# Altium project cando_pro.PrjPcb
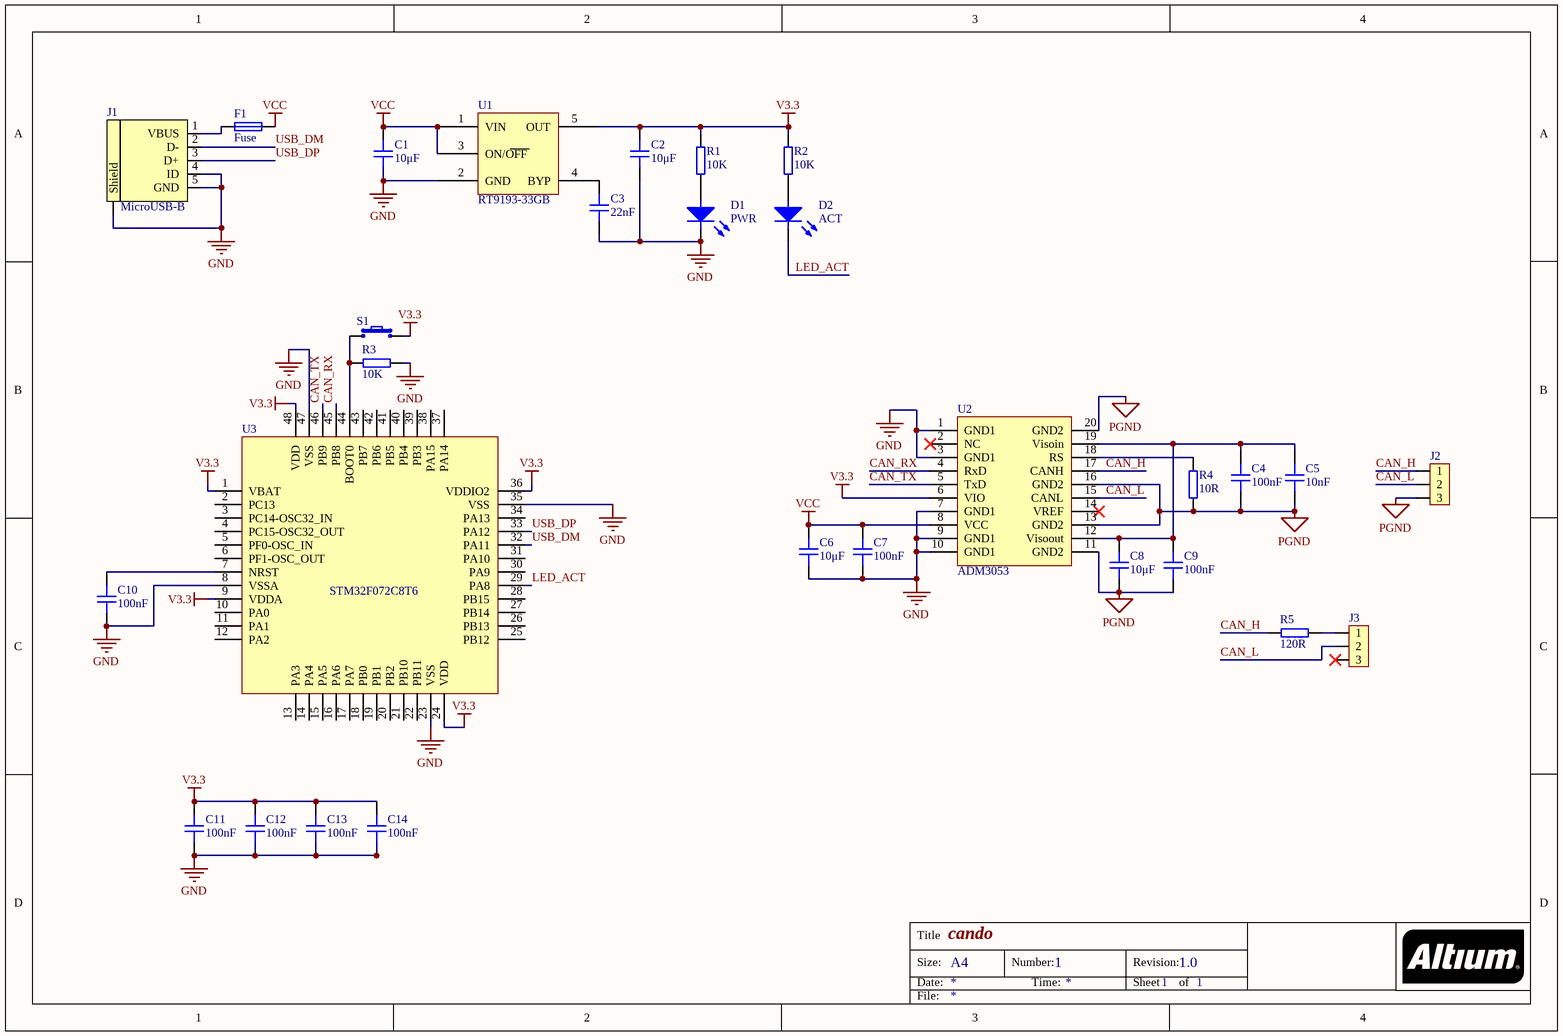
[diagram p0: cando_pro.SchDoc]
1 sheet, 29 parts. Net scope: global (net labels, ports and power ports of the same name join across sheets).
Board files: cando_pro.PcbDoc, cando_pro_set.PcbDoc

## Sheet cando_pro.SchDoc: cando
size A4; DocumentNumber: 1; Revision: 1.0; SheetNumber: 1; SheetTotal: 1; DrawnBy: SU; DocumentSize: A4; PCAName: cando

### Parts
C1  10μF  [0603C]
C2  10μF  [0603C]
C3  22nF  [0603C]
C4  100nF  [0603C]
C5  10nF  [0603C]
C6  10μF  [0603C]
C7  100nF  [0603C]
C8  10μF  [0603C]
C9  100nF  [0603C]
C10  100nF  [0603C]
C11  100nF  [0603C]
C12  100nF  [0603C]
C13  100nF  [0603C]
C14  100nF  [0603C]
D1  PWR  [LED_0603_GREEN]
D2  ACT  [LED_0603_BLUE]
F1  Fuse  [0805R]
J1  MicroUSB-B  [USB-Micro]
J2  (no value)  [MKDSN-2.54-3P]
J3  (no value)  [HEADER_2.54_3P]
R1  10K  [0603R]
R2  10K  [0603R]
R3  10K  [0603R]
R4  10R  [0603R]
R5  120R  [0603R]
S1  Button  [BTN_3*4]  (value not drawn)
U1  RT9193-33GB  [SOT-23-5]
U2  ADM3053  [RW-20]
U3  STM32F072C8T6  [STM-LQFP48_N]

### Nets
GND: C1.2 C2.2 C3.1 C6.2 C7.2 C10.2 C11.2 C12.2 C13.2 C14.2 D1.2(K) J1.4(ID) J1.5(GND) J1.6(Shield) R3.2 U1.2(GND) U2.1(GND1) U2.3(GND1) U2.7(GND1) U2.9(GND1) U2.10(GND1) U3.8(VSSA) U3.23(VSS) U3.35(VSS) U3.47(VSS)
PGND: C4.2 C5.2 C8.2 C9.2 J2.3 R4.1 U2.11(GND2) U2.13(GND2) U2.16(GND2) U2.20(GND2)
V3.3: C2.1 C11.1 C12.1 C13.1 C14.1 R1.1 R2.1 S1.2 U1.5(OUT) U2.6(VIO) U3.1(VBAT) U3.9(VDDA) U3.24(VDD) U3.36(VDDIO2) U3.48(VDD)
VCC: C1.1 C6.1 C7.1 F1.2 U1.1(VIN) U1.3(ON/OFF) U2.8(VCC)
CAN_H: J2.1 R5.1 U2.17(CANH)
CAN_L: J2.2 J3.2 U2.15(CANL)
CAN_RX: U2.4(RxD) U3.45(PB8)
CAN_TX: U2.5(TxD) U3.46(PB9)
LED_ACT: D2.2(K) U3.29(PA8)
USB_DM: J1.2(D-) U3.32(PA11)
USB_DP: J1.3(D+) U3.33(PA12)
NetC3_2: C3.2 U1.4(BYP)
NetC4_1: C4.1 C5.1 C8.1 C9.1 U2.12(Visoout) U2.19(Visoin)
NetC10_1: C10.1 U3.7(NRST)
NetD1_1: D1.1(A) R1.2
NetD2_1: D2.1(A) R2.2
NetF1_1: F1.1 J1.1(VBUS)
NetJ3_1: J3.1 R5.2
NetR3_1: R3.1 S1.1 U3.44(BOOT0)
NetR4_2: R4.2 U2.18(RS)

Not connected (* = marked no-connect by the designer): J3 3*; U2 2(NC)* 14(VREF)*; U3 2(PC13) 3(PC14-OSC32_IN) 4(PC15-OSC32_OUT) 5(PF0-OSC_IN) 6(PF1-OSC_OUT) 10(PA0) 11(PA1) 12(PA2) 13(PA3) 14(PA4) 15(PA5) 16(PA6) 17(PA7) 18(PB0) 19(PB1) 20(PB2) 21(PB10) 22(PB11) 25(PB12) 26(PB13) 27(PB14) 28(PB15) 30(PA9) 31(PA10) 34(PA13) 37(PA14) 38(PA15) 39(PB3) 40(PB4) 41(PB5) 42(PB6) 43(PB7)

### Notes on the sheet
- Title
- Size:
- Date:
- A4
- Number:
- Time:
- Revision:
- Sheet
- of
- File:

### Library data of the parts
C1-C14 = CAP: Capacitor
  C1 C2 C6 C8: Value: 10μF
  C3: Value: 22nF
  C4 C7 C9-C14: Value: 100nF
  C5: Value: 10nF
D1 D2 = LED
  D1: Value: PWR
  D2: Value: ACT
J1 = MiniUSB-AB-SMT: MicroUSB-B-SMT; Value: MicroUSB-B
J2 J3 = Junction_3P
R1-R5 = RES: Resistor
  R1-R3: Value: 10K
  R4: Value: 10R
  R5: Value: 120R
S1 = SW-PB: Value: Button
U1 = RT9193-33GB: Chip, RT9193-33GB, LDO Regulator; Value: RT9193-33GB
U2 = ADM3053: IC, Signal and power isolated CAN transceiver; Value: ADM3053
U3 = STM32F072C8T6: ARM Cortex-M0 32-bit MCU, 64 KB Flash, 8 KB Internal RAM, 39 I/Os, 48-pin LQFP, -40 to 85 degC, Tray; FLASH Size (Prog) (kB): 64; I/Os (High Current): 39; Internal RAM Size (kB): 8; Operating Frequency(F) (Processor speed) (MHz): 48; Supply Voltage(Vcc) min (V): 2.4; DatasheetVersion: Rev. 1; PackageVersion: Rev. 6, 06/2013; PackageReference: LQFP48; PackageDescription: 48-Pin Low Profile Quad Flat Package, 7 x 7 mm Body, 0.5 mm Pitch; Supplier 1: Digi-Key; Supplier Part Number 1: 497-14043-ND; Supplier 2: Newark; Supplier Part Number 2: 06X3647; Supplier 3: Mouser; Supplier Part Number 3: 511-STM32F030C8T6; Core: ARM Cortex-M0; Packing: Tray; Mounting Technology: Surface Mount; PartNumber: STM32F072C8T6; ComponentLink1Description: Manufacturer URL; ComponentLink1URL: http://www.st.com/web/en/home.html; ComponentLink2Description: Datasheet; ComponentLink2URL: http://www.st.com/st-web-ui/static/active/en/resource/technical/document/datasheet/DM00088500.pdf; ComponentLink3Description: Package Specification; ComponentLink3URL: http://www.st.com/st-web-ui/static/active/en/resource/technical/document/datasheet/DM00058181.pdf